# EAGLE design LCD BackPack wider (EAGLE 9.5.2)
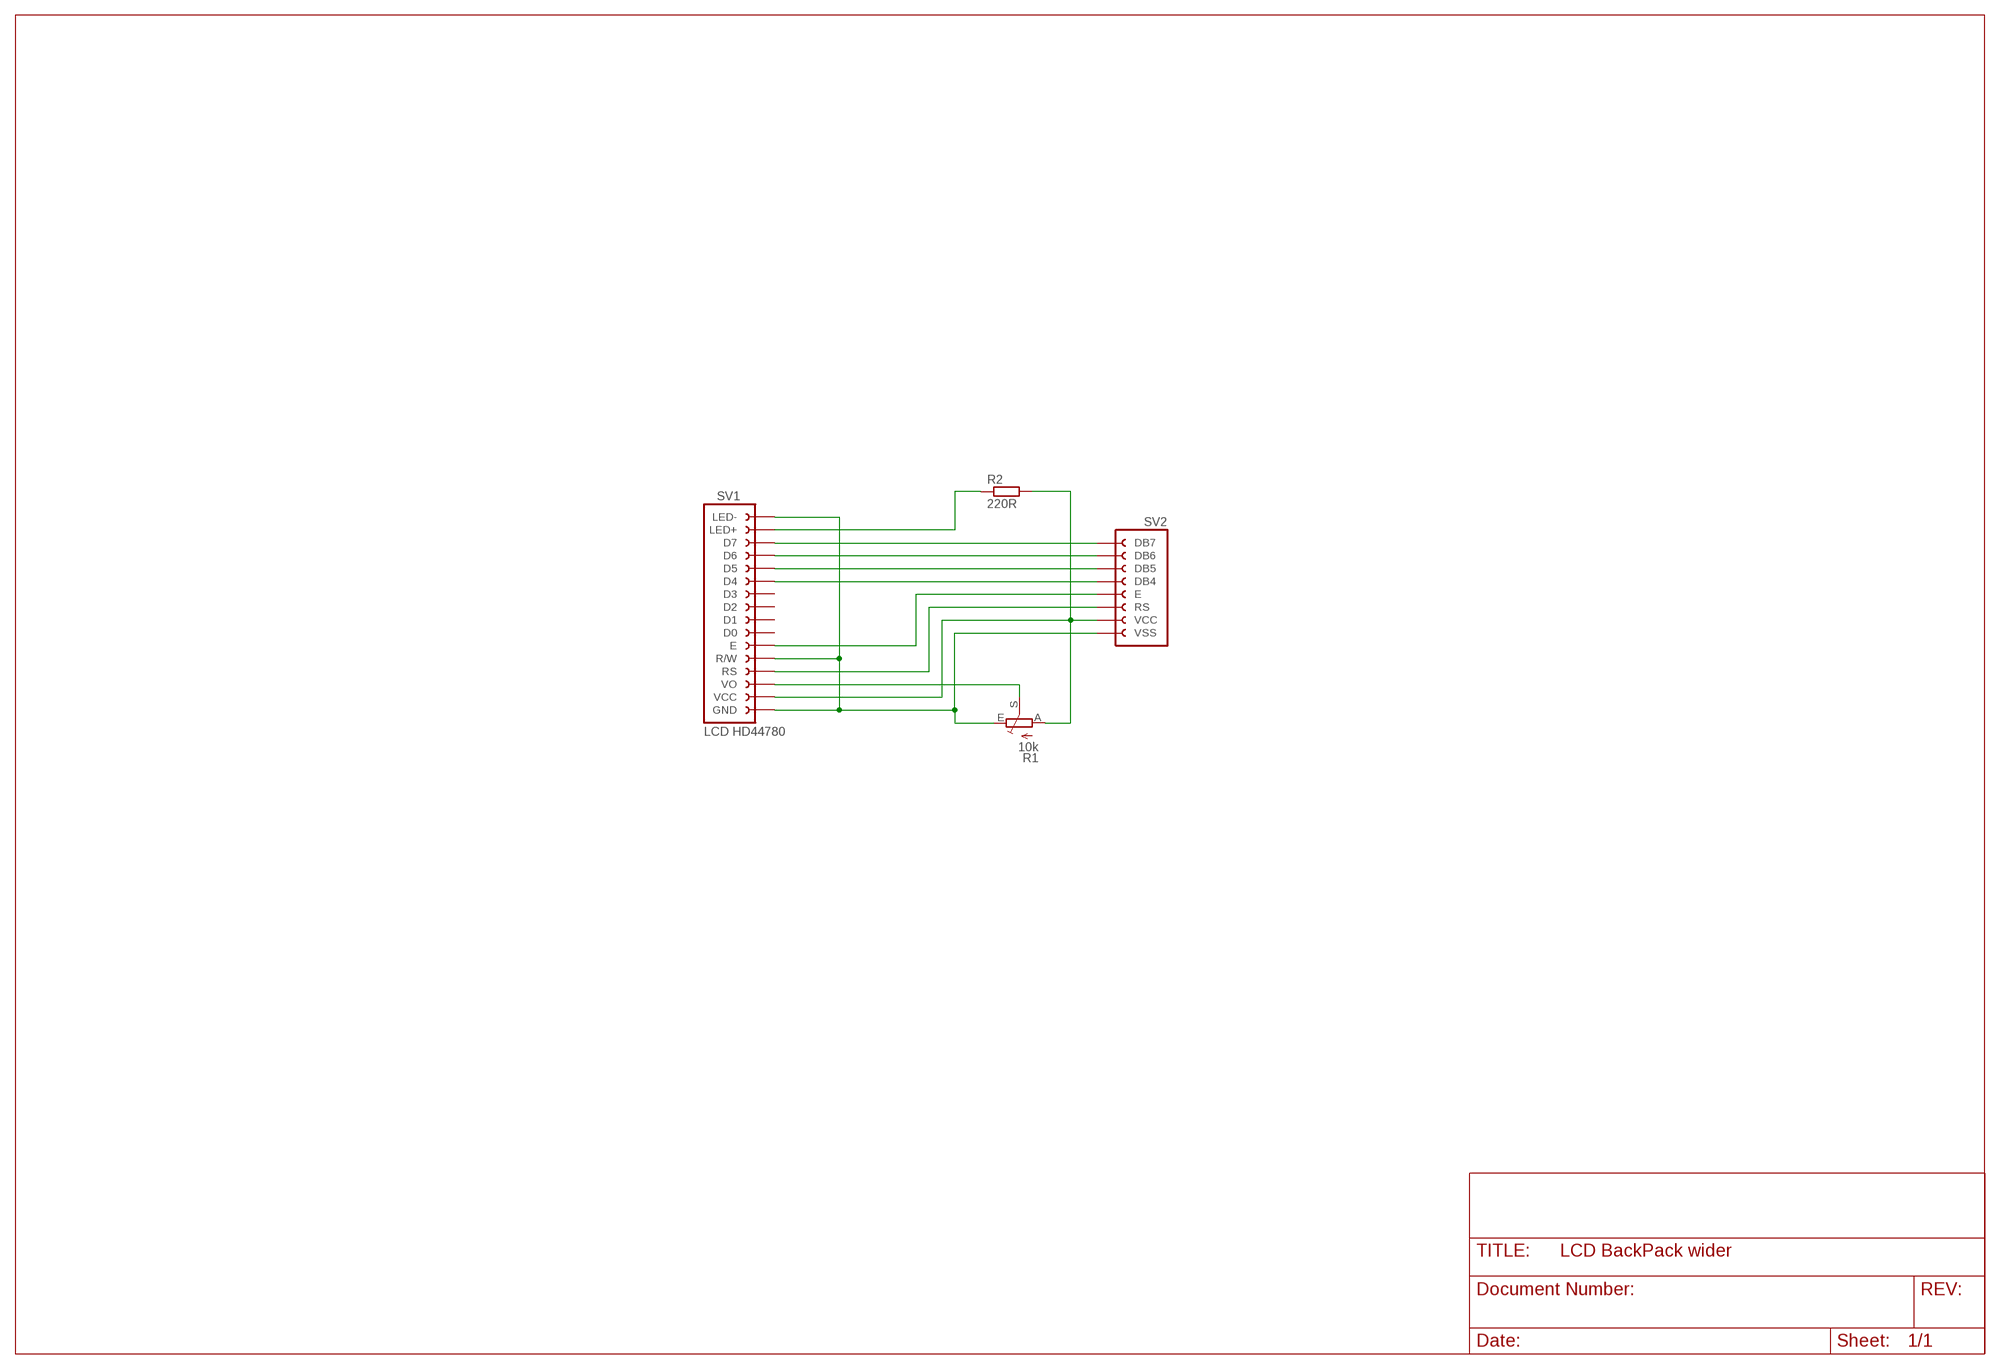
[diagram p0: schematic, sheet 1]

## Parts
R1  10k  POTENTIOMETER_CA6VCA6V  [CA6V]
R2  220R  R-EU_0204/7  [0204/7]
SV1  LCD-HD44780-16-PIN_FEMALE_HEADER  [LCD-HD44780-16-PIN_FEMALE_HEADER]
SV2  LCD-CONTROL_8-PIN_FEMALE_HEADER  [LCD-CONTROL_8-PIN_FEMALE_HEADER]

## Nets
N$1: SV1.D7 SV2.DB7
N$2: SV1.D6 SV2.DB6
N$3: SV1.D5 SV2.DB5
N$4: SV1.D4 SV2.DB4
N$5: SV1.E SV2.E
N$6: SV1.RS SV2.RS
N$7 [My20]: R1.A R2.2 SV1.VCC SV2.VCC
N$8 [My20]: R1.E SV1.GND SV1.LED- SV1.R/W SV2.VSS
N$10: R1.S SV1.VO
N$12 [My20]: R2.1 SV1.LED+
Unconnected: SV1.D0 SV1.D1 SV1.D2 SV1.D3

## Library data of the parts
R1 = myLib-04-OftenUsed:POTENTIOMETER_CA6V: TRIM POTENTIOMETER Trim Potentiometer CA6V
R2 = resistor:R-EU_: RESISTOR, European symbol
SV1 = myLib-01-Headers:LCD-HD44780-16-PIN_FEMALE_HEADER: Header for the 16 pin HD44780 LCD module Female; OC_FARNELL: unknown; OC_NEWARK: unknown
SV2 = myLib-01-Headers:LCD-CONTROL_8-PIN_FEMALE_HEADER: LCD-Control 8-pin FEMALE HEADER

## Net classes
1 My20: width 0.508 mm, clearance 0.254 mm

## Board
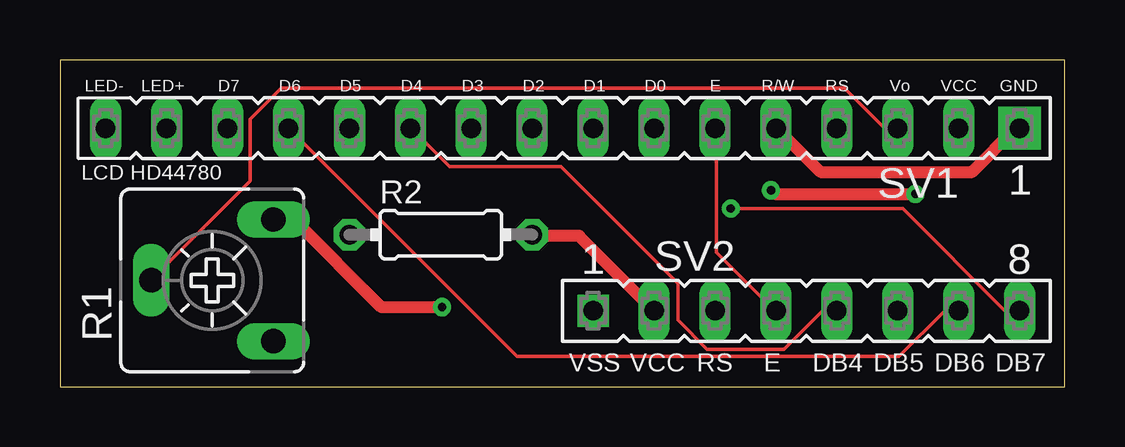
[diagram p1: board, top side]
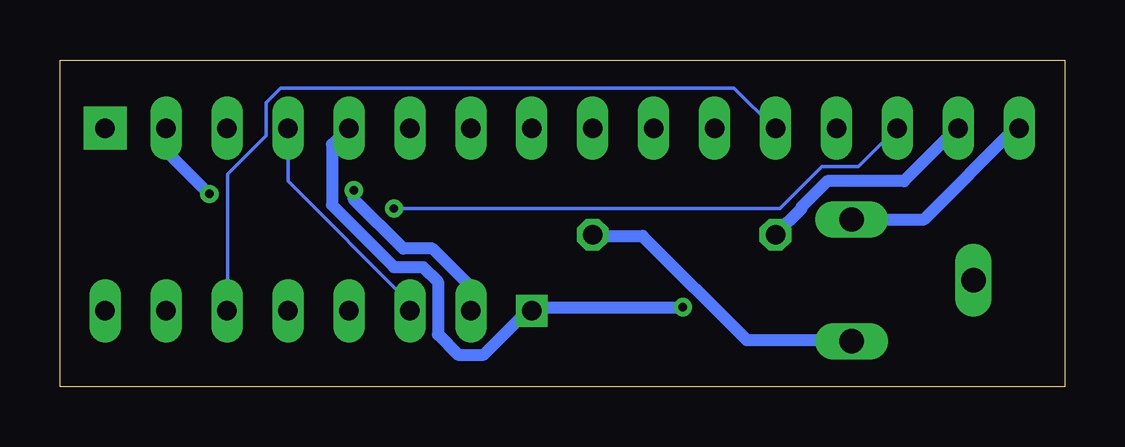
[diagram p2: board, bottom side, seen from below]

Size 41.89 x 13.64 mm. Coordinates in mm from the lower left corner, seen from the top.
Outline: 0,0 41.89,0 41.89,13.64 0,13.64 0,0
Copper layers (1*16): Top 0.035mm / dielectric 1.5mm / Bottom 0.035mm
Design rules "default": minimum track width 6mil, minimum drill 0.35mm, track to track 6mil, track to pad 6mil, pad to pad 6mil, via to via 6mil, smd to smd 6mil, copper to edge 40mil, drill to drill 6mil, minimum pad ring 10mil, minimum via ring 8mil, stop-mask expansion 4mil, vias tented up to drill 0mil, thermal gap 10mil

### Footprints (pad centres in the part's own frame; a part is rotated, then mirrored left to right if it is on the bottom)
CA6V = drill 1.016 long: A -2.54,-2.54; E 2.54,-2.54; S 0,2.54
0204/7 = drill 0.813 octagon: 1 -3.81,0; 2 3.81,0
LCD-HD44780-16-PIN_FEMALE_HEADER = drill 0.813 long: D0 15.24,0; D1 17.78,0; D2 20.32,0; D3 22.86,0; D4 25.4,0; D5 27.94,0; D6 30.48,0; D7 33.02,0; E 12.7,0; LED+ 35.56,0; LED- 38.1,0; R/W 10.16,0; RS 7.62,0; VCC 2.54,0; VO 5.08,0 | drill 0.813 pad 1.778 square: GND 0,0
LCD-CONTROL_8-PIN_FEMALE_HEADER = drill 0.813 long: DB4 10.16,0; DB5 12.7,0; DB6 15.24,0; DB7 17.78,0; E 7.62,0; RS 5.08,0; VCC 2.54,0 | drill 0.813 square: VSS 0,0

### Placement (x,y rotation side)
R1  6.35,4.45 90 top
R2  15.88,6.35 0 top
SV1  40.01,10.8 180 top
SV2  22.23,3.17 0 top

### Tracks (layer width: path | path; a pad name or v marks a point on that pad's centre or on a via)
N$1  (via drill 0.35)
  Top 0.152: SV2.DB7 39.4,3.17 35.13,7.44 v27.96,7.44
  Bottom 0.152: v27.96,7.44 11.89,7.44 10.13,9.2 8.61,9.2 7.01,10.8 SV1.D7
N$2
  Top 0.152: SV2.DB6 36.88,3.17 34.98,1.27 19.05,1.27 SV1.D6
N$3
  Bottom 0.152: SV2.DB5 34.9,3.17 34.9,8.89 33.3,10.49 33.3,11.86 32.69,12.47 13.79,12.47 12.12,10.8 SV1.D5
N$4
  Top 0.152: SV2.DB4 31.77,3.17 30.18,1.58 26.98,1.58 25.76,2.79 25.76,4.32 20.88,9.2 16.23,9.2 14.63,10.8 SV1.D4
N$5
  Top 0.152: SV1.E 27.36,10.8 27.36,5.61 29.79,3.17 SV2.E
N$6
  Bottom 0.152: SV1.RS 32.38,8.58 27.36,3.56 27.36,3.17 SV2.RS
N$7  (via drill 0.35)
  Top 0.508: SV2.VCC 21.64,6.3 19.74,6.3 R2.2 | v35.66,8.05 29.79,8.05 v29.64,8.2
  Bottom 0.508: v35.66,8.05 37.41,9.8 37.41,10.8 SV1.VCC | v29.64,8.2 29.64,7.82 27.58,5.77 26.36,5.77 24.77,4.17 SV2.VCC | R1.A 8.91,1.96 13.26,1.96 17.6,6.3 19.66,6.3 R2.2
N$8  (via drill 0.35)
  Top 0.508: SV1.GND 39.85,10.8 38.02,8.97 31.7,8.97 29.87,10.8 SV1.R/W | R1.E 9.75,6.98 13.41,3.33 v15.93,3.33
  Bottom 0.508: SV1.LED- 2.06,10.8 5.87,6.98 R1.E | SV1.R/W 29.87,10.8 30.56,10.11 30.56,7.59 27.96,5 26.75,5 26.14,4.39 26.14,2.18 25.3,1.35 24.23,1.35 22.4,3.17 SV2.VSS 22.02,3.33 v15.93,3.33
N$10
  Top 0.152: SV1.VO 34.37,10.8 32.69,12.47 9.22,12.47 7.92,11.18 7.92,8.58 3.81,4.47 R1.S
N$12
  Bottom 0.508: R2.1 10.97,7.44 10.97,7.52 9.91,8.58 6.71,8.58 4.5,10.8 SV1.LED+

### Text on the board
tValues: LCD BackPack / Design: Jon Sagebrand / jonsagebrand@gmail.com | Other side / towards LCD